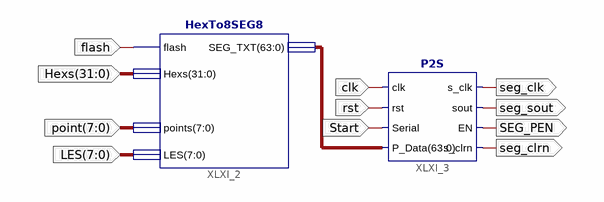
[diagram p0: schematic sheet 1]
// Xilinx ISE schematic Sseg_Dev.sch (kintex7) as structural Verilog: 2 symbols, 11 ports
module Sseg_Dev (
  input  flash,
  input  [31:0] Hexs,
  input  [7:0] point,
  input  [7:0] LES,
  input  Start,
  input  rst,
  input  clk,
  output seg_clrn,
  output SEG_PEN,
  output seg_sout,
  output seg_clk
);

  wire [63:0] XLXN_9;

  HexTo8SEG8 XLXI_2 (.flash(flash), .Hexs(Hexs), .points(point), .LES(LES), .SEG_TXT(XLXN_9));
  P2S XLXI_3 (
    .s_clrn(seg_clrn), .sout(seg_sout), .rst(rst), .EN(SEG_PEN), .Serial(Start), .clk(clk), .s_clk(seg_clk),
    .P_Data(XLXN_9));
endmodule
